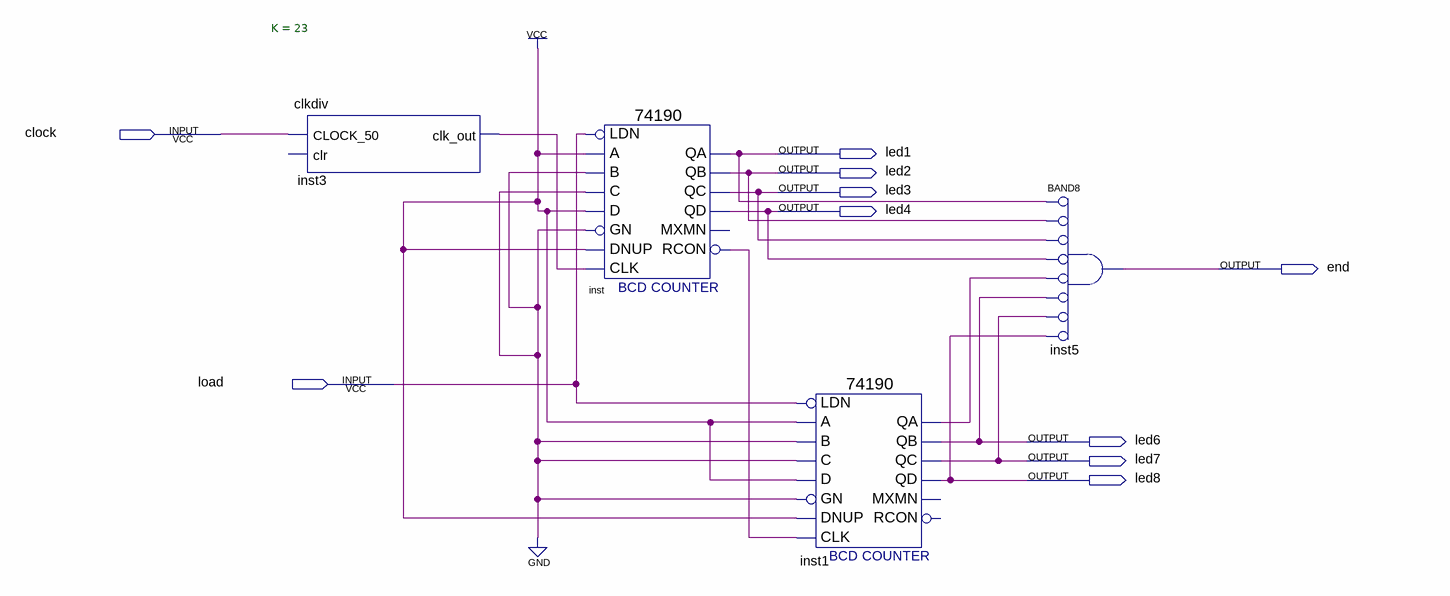
[diagram p0: schematic sheet]
// Quartus schematic count.bdf as structural Verilog: 4 symbols, 10 pins
module count (
  input  clock,
  input  load,
  output led1,
  output led2,
  output led3,
  output led4,
  output \end ,
  output led6,
  output led7,
  output led8
);

  wire inst1_qa, inst3_clk_out, inst_rcon;

  clkdiv #(.K(23)) inst3 (.CLOCK_50(clock), .clk_out(inst3_clk_out));  // open: clr
  \74190  inst (
    .LDN(load), .A(1'b1), .C(1'b0), .B(1'b0), .D(1'b1), .GN(1'b0), .CLK(inst3_clk_out), .DNUP(1'b1),
    .QA(led1), .QB(led2), .QD(led4), .QC(led3), .RCON(inst_rcon));  // open: MXMN
  \74190  inst1 (
    .LDN(load), .A(1'b1), .C(1'b0), .B(1'b0), .D(1'b1), .GN(1'b0), .CLK(inst_rcon), .DNUP(1'b1),
    .QA(inst1_qa), .QB(led6), .QD(led8), .QC(led7));  // open: MXMN, RCON
  and inst5 (\end , ~led1, ~led2, ~led3, ~led4, ~inst1_qa, ~led6, ~led7, ~led8);  // BAND8
endmodule
